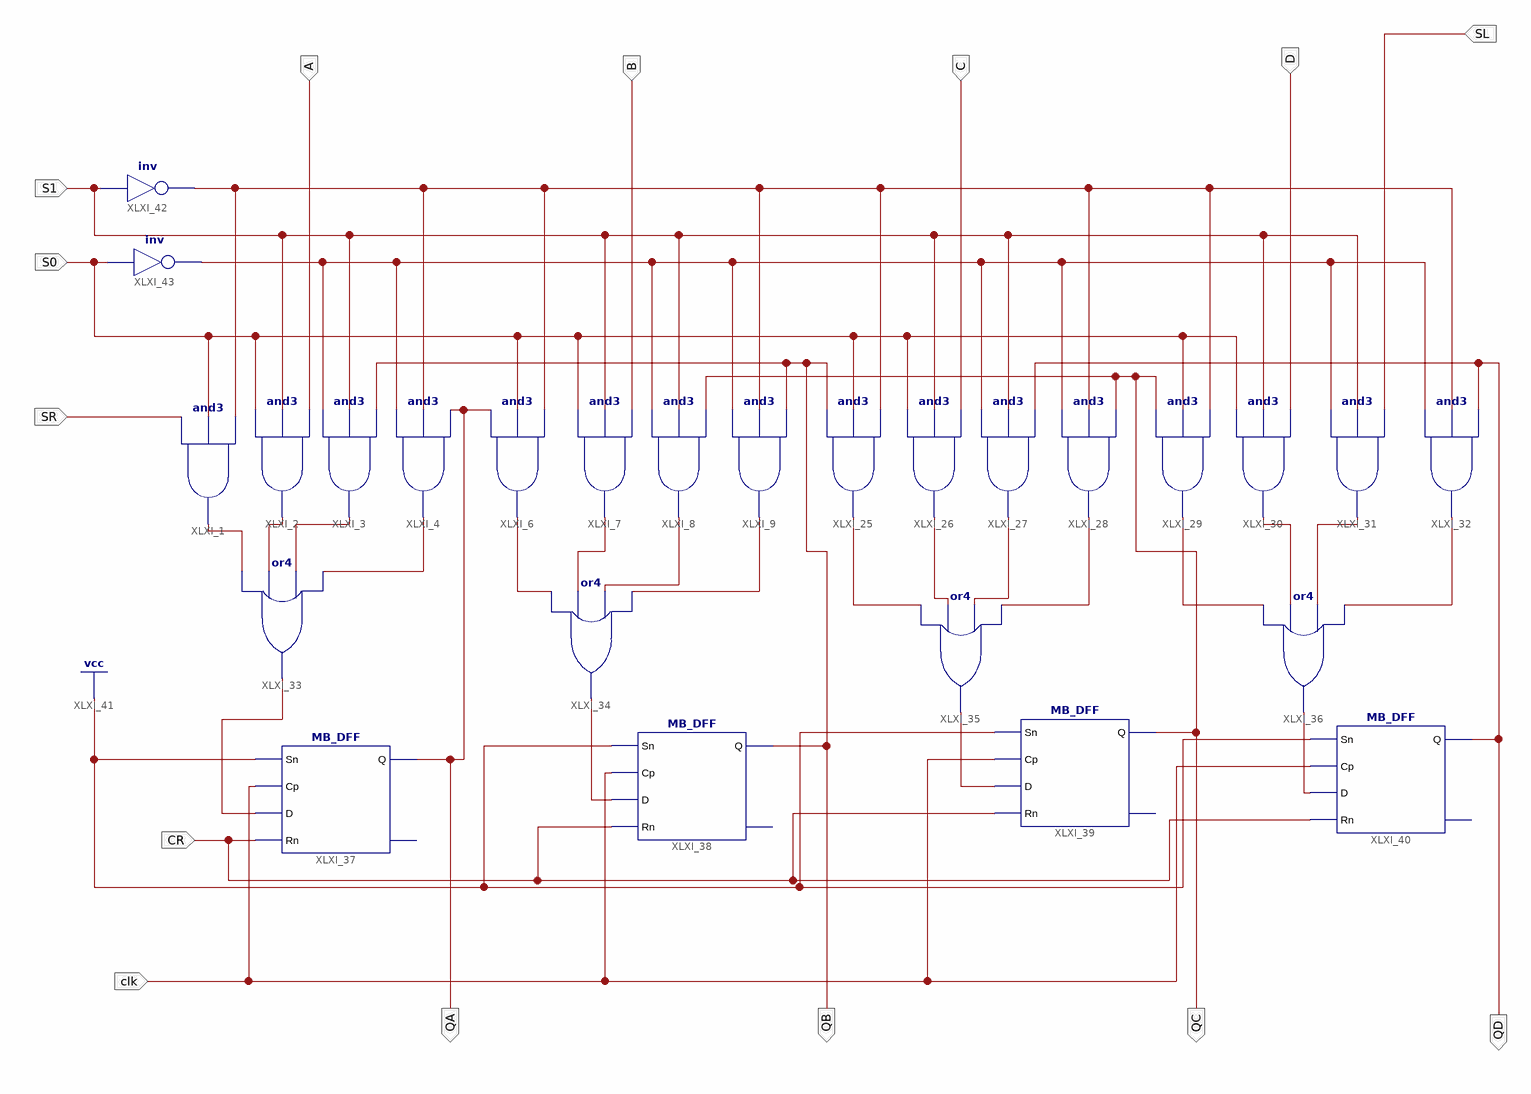
[diagram p0: schematic sheet 1]
// Xilinx ISE schematic DM74LS194.sch (kintex7) as structural Verilog: 26 symbols, 14 ports
module DM74LS194 (
  input  CR,
  input  clk,
  input  SR,
  input  S1,
  input  S0,
  input  SL,
  input  A,
  input  B,
  input  C,
  input  D,
  output QA,
  output QB,
  output QC,
  output QD
);

  wire XLXN_1, XLXN_2, XLXN_3, XLXN_4, XLXN_5, XLXN_6, XLXN_7, XLXN_8, XLXN_9, XLXN_10, XLXN_11, XLXN_12,
       XLXN_13, XLXN_14, XLXN_15, XLXN_16, XLXN_17, XLXN_18, XLXN_19, XLXN_20, XLXN_49, XLXN_50;

  and XLXI_1 (XLXN_1, SR, S0, XLXN_49);
  and XLXI_2 (XLXN_2, S0, S1, A);
  and XLXI_3 (XLXN_3, XLXN_50, S1, QB);
  and XLXI_4 (XLXN_4, XLXN_50, XLXN_49, QA);
  and XLXI_6 (XLXN_5, QA, S0, XLXN_49);
  and XLXI_7 (XLXN_6, S0, S1, B);
  and XLXI_8 (XLXN_7, XLXN_50, S1, QC);
  and XLXI_9 (XLXN_8, XLXN_50, XLXN_49, QB);
  and XLXI_25 (XLXN_9, QB, S0, XLXN_49);
  and XLXI_26 (XLXN_10, S0, S1, C);
  and XLXI_27 (XLXN_11, XLXN_50, S1, QD);
  and XLXI_28 (XLXN_12, XLXN_50, XLXN_49, QC);
  and XLXI_29 (XLXN_13, QC, S0, XLXN_49);
  and XLXI_30 (XLXN_14, S0, S1, D);
  and XLXI_31 (XLXN_15, XLXN_50, S1, SL);
  and XLXI_32 (XLXN_16, XLXN_50, XLXN_49, QD);
  or XLXI_33 (XLXN_17, XLXN_1, XLXN_2, XLXN_3, XLXN_4);
  or XLXI_34 (XLXN_18, XLXN_5, XLXN_6, XLXN_7, XLXN_8);
  or XLXI_35 (XLXN_19, XLXN_9, XLXN_10, XLXN_11, XLXN_12);
  or XLXI_36 (XLXN_20, XLXN_13, XLXN_14, XLXN_15, XLXN_16);
  MB_DFF XLXI_37 (.Sn(1'b1), .Cp(clk), .D(XLXN_17), .Rn(CR), .Q(QA));  // open: Qn
  MB_DFF XLXI_38 (.Sn(1'b1), .Cp(clk), .D(XLXN_18), .Rn(CR), .Q(QB));  // open: Qn
  MB_DFF XLXI_39 (.Sn(1'b1), .Cp(clk), .D(XLXN_19), .Rn(CR), .Q(QC));  // open: Qn
  MB_DFF XLXI_40 (.Sn(1'b1), .Cp(clk), .D(XLXN_20), .Rn(CR), .Q(QD));  // open: Qn
  not XLXI_42 (XLXN_49, S1);
  not XLXI_43 (XLXN_50, S0);
endmodule
